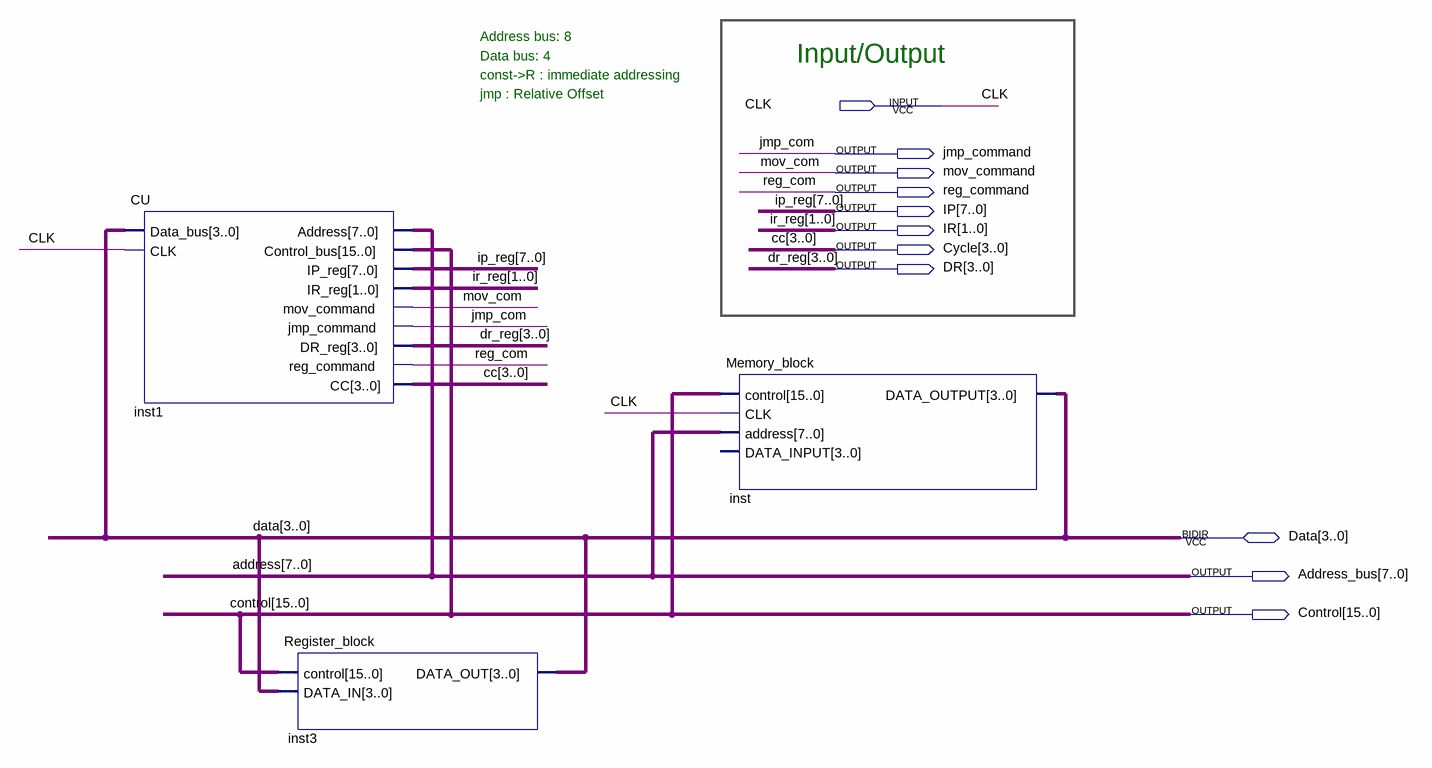
[diagram p0: schematic sheet]
// Quartus schematic main.bdf as structural Verilog: 3 symbols, 11 pins
module main (
  input  CLK,
  inout  [3:0] Data,
  output jmp_command,
  output mov_command,
  output reg_command,
  output [7:0] IP,
  output [1:0] IR,
  output [3:0] Cycle,
  output [3:0] DR,
  output [7:0] Address_bus,
  output [15:0] Control
);

  CU inst1 (
    .Data_bus(Data), .CLK(CLK), .Address(Address_bus), .Control_bus(Control), .IP_reg(IP), .IR_reg(IR),
    .mov_command(mov_command), .jmp_command(jmp_command), .DR_reg(DR), .reg_command(reg_command), .CC(Cycle));
  Register_block inst3 (.control(Control), .DATA_IN(Data), .DATA_OUT(Data));
  Memory_block inst (.control(Control), .CLK(CLK), .address(Address_bus), .DATA_OUTPUT(Data));  // open: DATA_INPUT

  // Other names for the same wires on the sheet: address[7:0] = Address_bus; cc[3:0] = Cycle; dr_reg[3:0] = DR;
  //   ip_reg[7:0] = IP; ir_reg[1:0] = IR; jmp_com = jmp_command; mov_com = mov_command; reg_com = reg_command

  // Notes on the sheet:
  //   Address bus: 8
  //   Input/Output
  //   Data bus: 4
  //   const->R : immediate addressing
  //   jmp : Relative Offset
endmodule
